# EAGLE design Encoder_y_alarmas (EAGLE 6.1)

## Sheet 1 of 2
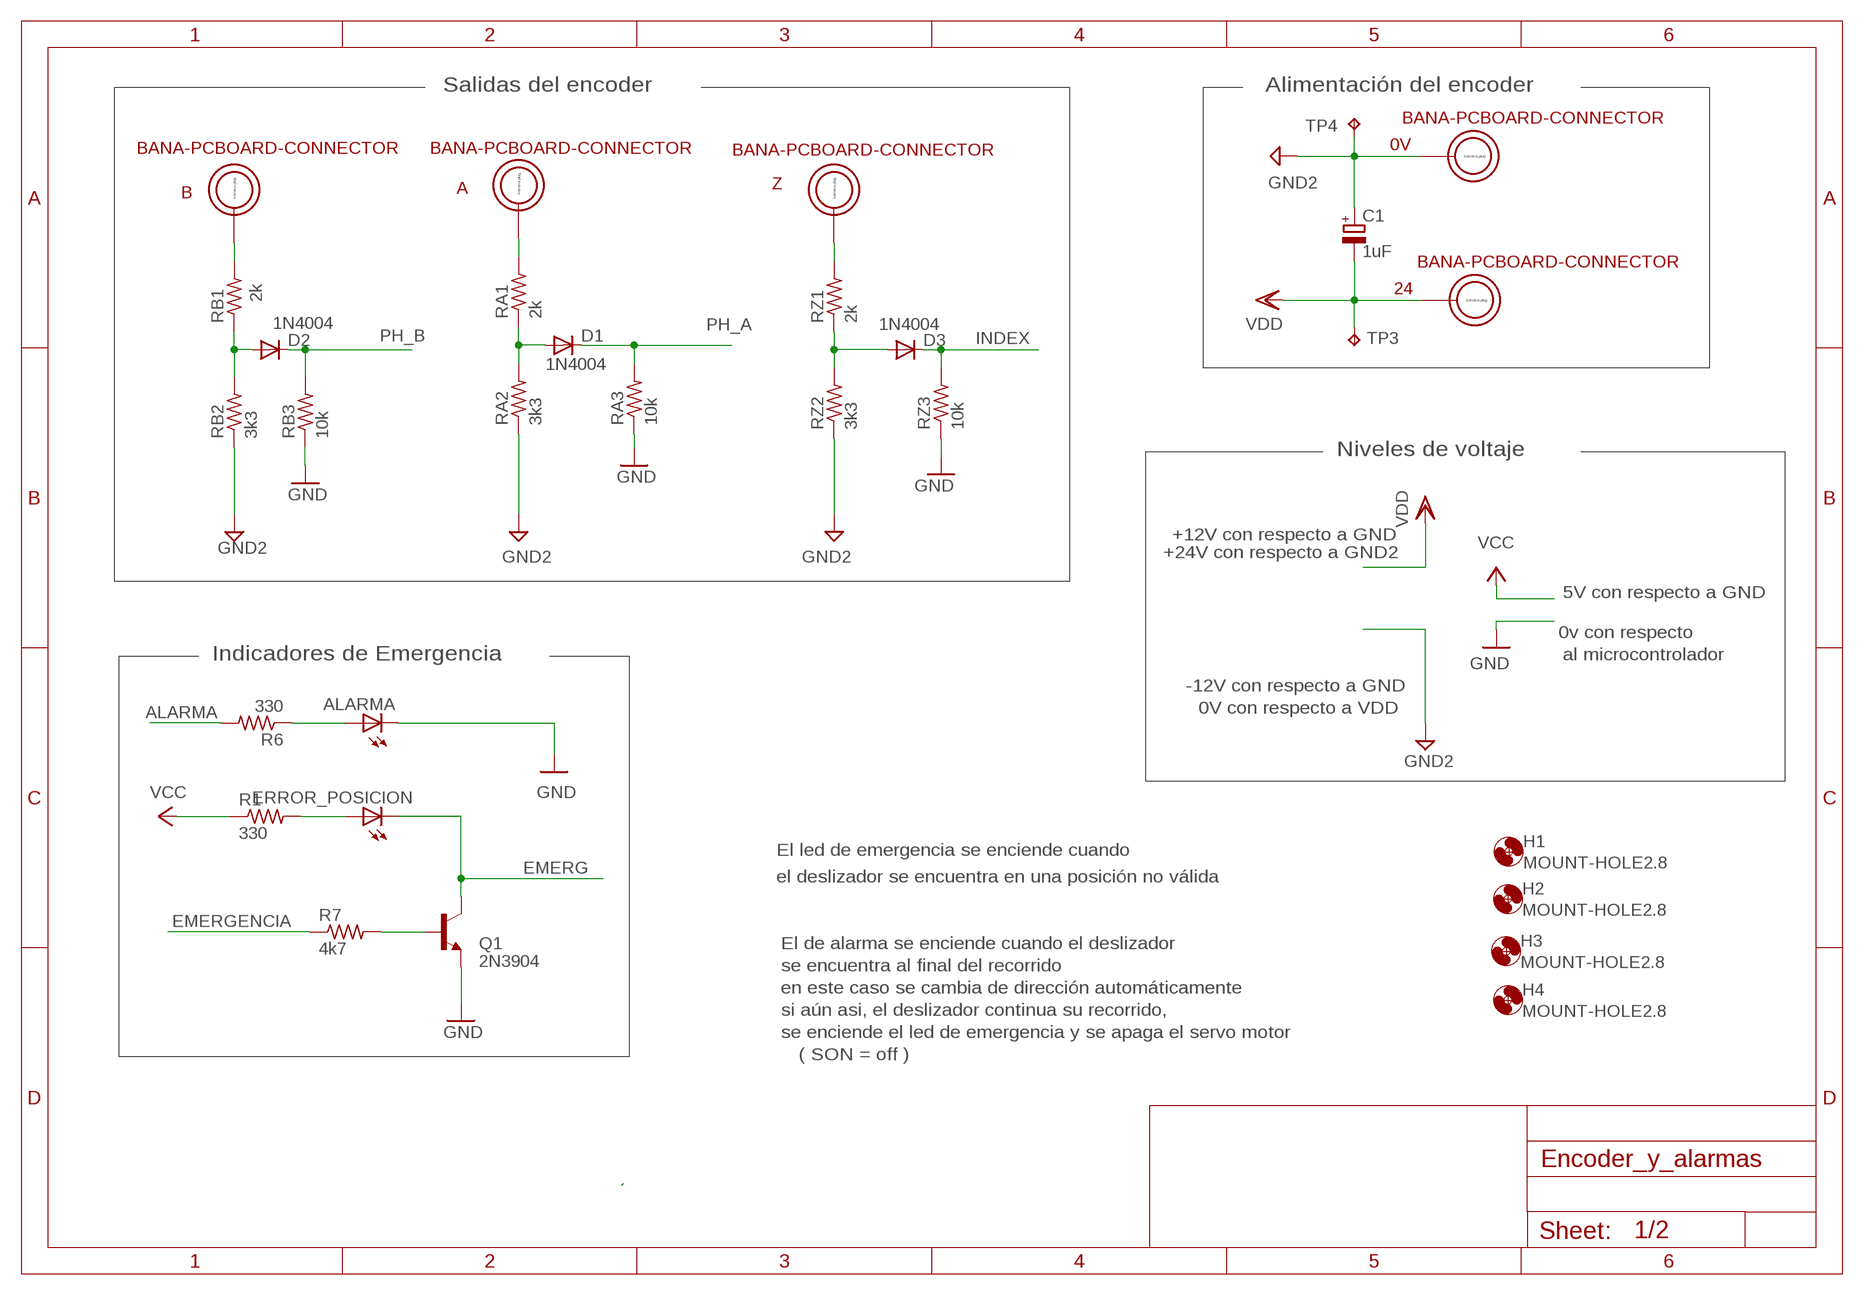
[diagram p0: schematic, sheet 1]

### Parts
0V  BANA-PCBOARD-CONNECTOR  [BANA_PLUG]
24  BANA-PCBOARD-CONNECTOR  [BANA_PLUG]
A  BANA-PCBOARD-CONNECTOR  [BANA_PLUG]
ALARMA  LED5MM  [LED5MM]
B  BANA-PCBOARD-CONNECTOR  [BANA_PLUG]
C1  1uF  CPOL-EUE2.5-6  [E2,5-6]
D1  1N4004  [DO41-10]
D2  1N4004  [DO41-10]
D3  1N4004  [DO41-10]
ERROR_POSICION  LED5MM  [LED5MM]
H1  MOUNT-HOLE2.8  [2,8]
H2  MOUNT-HOLE2.8  [2,8]
H3  MOUNT-HOLE2.8  [2,8]
H4  MOUNT-HOLE2.8  [2,8]
Q1  2N3904  [TO92]
R1  330  R-US_0204/7  [0204/7]
R6  330  R-US_0204/7  [0204/7]
R7  4k7  R-US_0204/7  [0204/7]
RA1  2k  R-US_0204/7  [0204/7]
RA2  3k3  R-US_0204/7  [0204/7]
RA3  10k  R-US_0204/7  [0204/7]
RB1  2k  R-US_0204/7  [0204/7]
RB2  3k3  R-US_0204/7  [0204/7]
RB3  10k  R-US_0204/7  [0204/7]
RZ1  2k  R-US_0204/7  [0204/7]
RZ2  3k3  R-US_0204/7  [0204/7]
RZ3  10k  R-US_0204/7  [0204/7]
TP3  TPB2,54  [B2,54]
TP4  TPB2,54  [B2,54]
Z  BANA-PCBOARD-CONNECTOR  [BANA_PLUG]

### Nets
ALARMA: R6.2 ; also sheet 2
EMERG: ERROR_POSICION.K(C) Q1.1(C) ; also sheet 2
EMERGENCIA: R7.1 ; also sheet 2
GND [tierra_5v]: ALARMA.K(C) Q1.3(E) RA3.1 RB3.1 RZ3.1 ; also sheet 2
GND2: 0V.P$1 C1.+ RA2.1 RB2.1 RZ2.1 TP4.TP ; also sheet 2
INDEX: D3.C RZ3.2 ; also sheet 2
N$1: Q1.2(B) R7.2
N$3: ERROR_POSICION.A R1.2
N$6: ALARMA.A R6.1
N$8: D1.A RA1.1 RA2.2
N$10: D2.A RB1.1 RB2.2
N$12: RZ1.2 Z.P$1
N$16: B.P$1 RB1.2
N$17: A.P$1 RA1.2
N$19: D3.A RZ1.1 RZ2.2
PH_A: D1.C RA3.2 ; also sheet 2
PH_B: D2.C RB3.2 ; also sheet 2
VCC [fuente_5v]: R1.1 ; also sheet 2
VDD [fuente_24]: 24.P$1 C1.- TP3.TP ; also sheet 2

### Notes on the sheet
- Salidas del encoder | Alimentación del encoder
- Niveles de voltaje
- +12V con respecto a GND
- +24V con respecto a GND2
- 5V con respecto a GND
- 0v con respecto
- Indicadores de Emergencia | al microcontrolador
- -12V con respecto a GND
- 0V con respecto a VDD
- El led de emergencia se enciende cuando
- el deslizador se encuentra en una posición no válida
- El de alarma se enciende cuando el deslizador
- se encuentra al final del recorrido
- en este caso se cambia de dirección automáticamente
- si aún asi, el deslizador continua su recorrido,
- se enciende el led de emergencia y se apaga el servo motor
- ( SON = off )

## Sheet 2 of 2
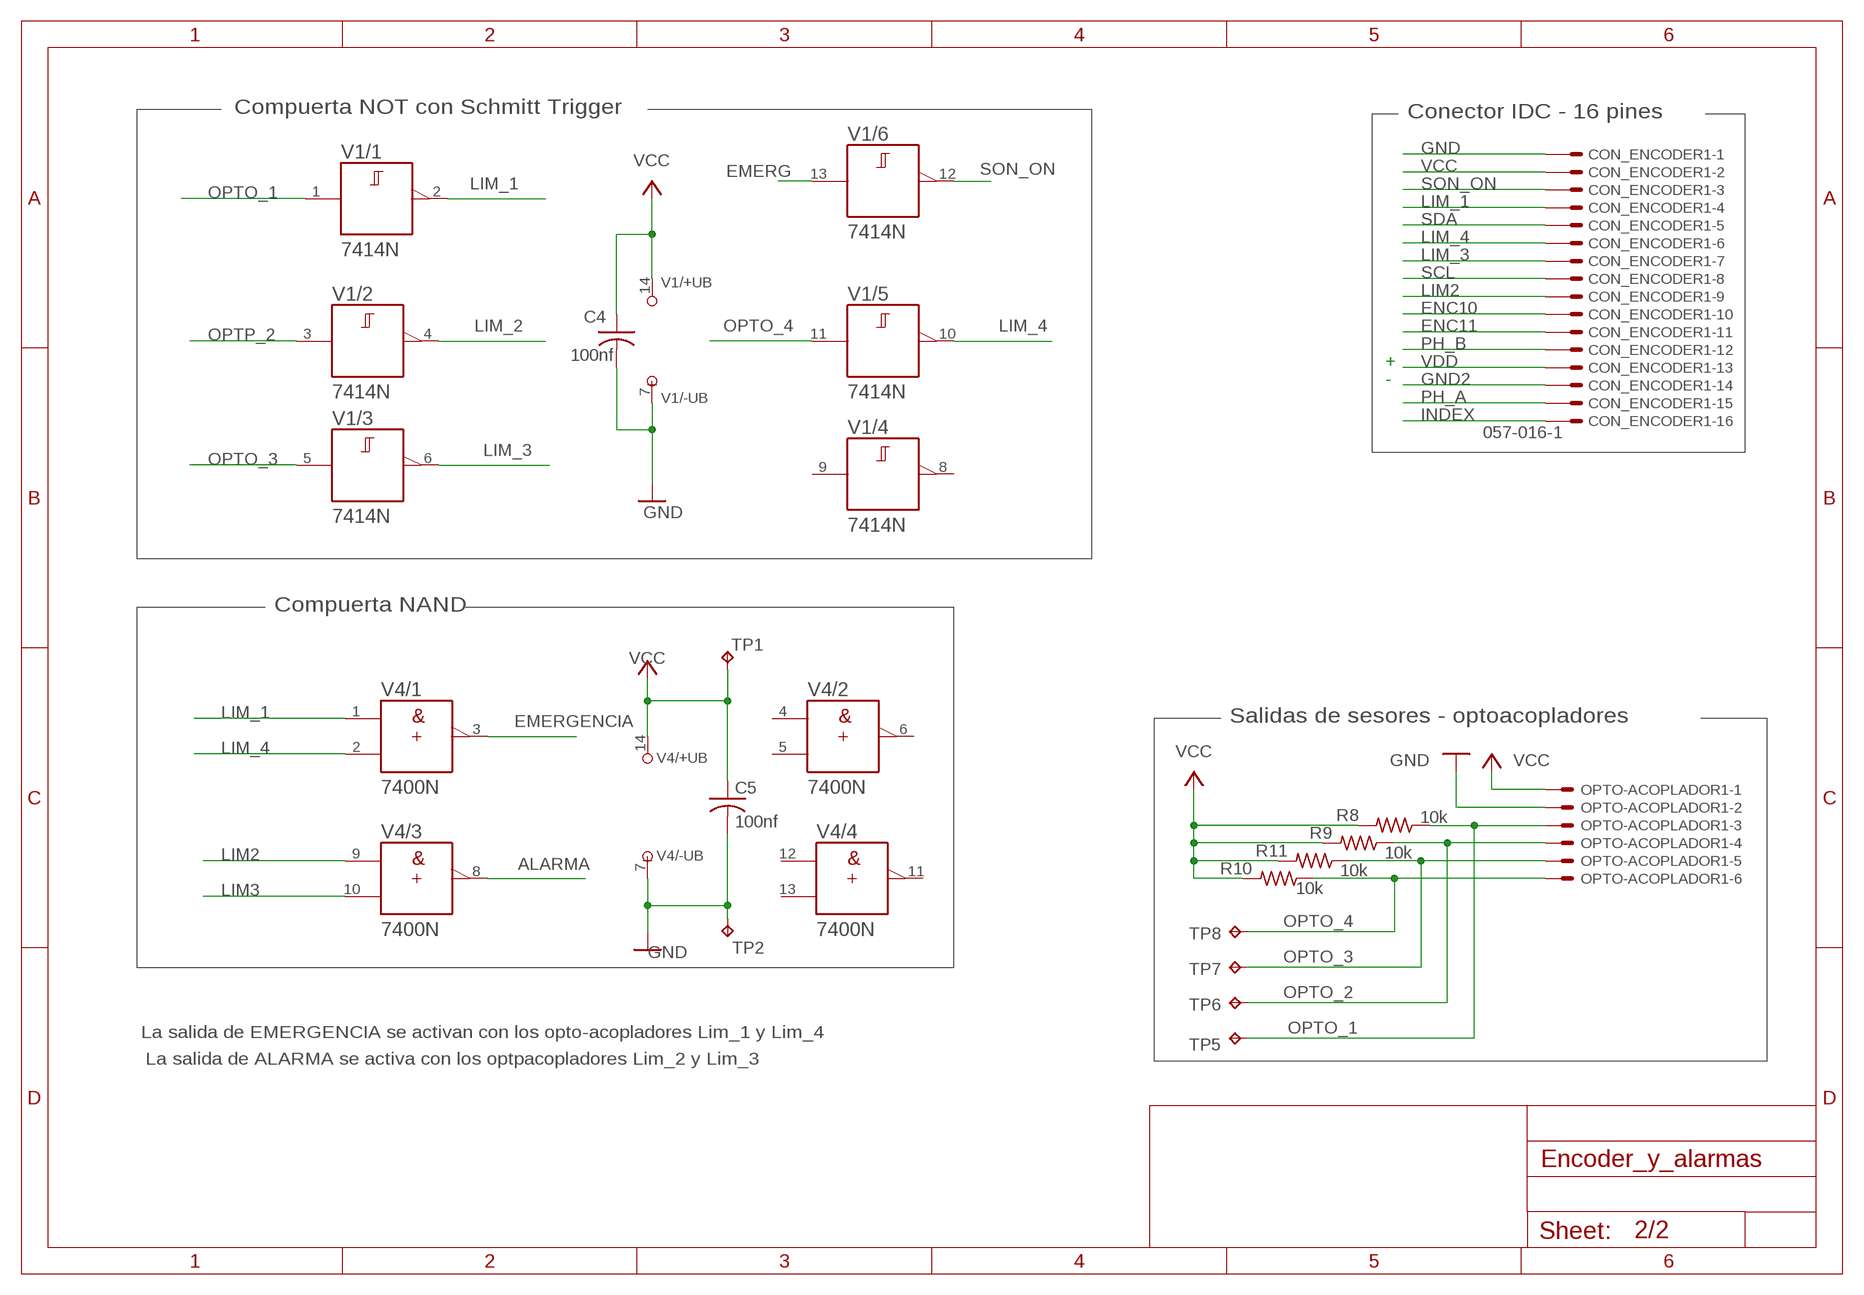
[diagram p1: schematic, sheet 2]

### Parts
C4  100nf  C-US025-024X044  [C025-024X044]
C5  100nf  C-US025-024X044  [C025-024X044]
CON_ENCODER1  057-016-1  [057-016-1]
OPTO-ACOPLADOR1  22-23-2061  [22-23-2061]
R8  10k  R-US_0204/7  [0204/7]
R9  10k  R-US_0204/7  [0204/7]
R10  10k  R-US_0204/7  [0204/7]
R11  10k  R-US_0204/7  [0204/7]
TP1  TPB2,54  [B2,54]
TP2  TPB2,54  [B2,54]
TP5  TPB2,54  [B2,54]
TP6  TPB2,54  [B2,54]
TP7  TPB2,54  [B2,54]
TP8  TPB2,54  [B2,54]
V1  7414N  [DIL14]
V4  7400N  [DIL14]

### Nets
ALARMA: V4.8(/3:Y) ; also sheet 1
EMERG: V1.13(/6:A) ; also sheet 1
EMERGENCIA: V4.3(/1:Y) ; also sheet 1
ENC10: CON_ENCODER1.10
ENC11: CON_ENCODER1.11
GND [tierra_5v]: C4.2 C5.2 CON_ENCODER1.1 OPTO-ACOPLADOR1.2 TP2.TP V1.7(/-UB:-UB) V4.7(/-UB:-UB) ; also sheet 1
GND2: CON_ENCODER1.14 ; also sheet 1
INDEX: CON_ENCODER1.16 ; also sheet 1
LIM2: CON_ENCODER1.9 V4.9(/3:A)
LIM3: V4.10(/3:B)
LIM_1: CON_ENCODER1.4 V1.2(/1:Y) V4.1(/1:A)
LIM_2: V1.4(/2:Y)
LIM_3: CON_ENCODER1.7 V1.6(/3:Y)
LIM_4: CON_ENCODER1.6 V1.10(/5:Y) V4.2(/1:B)
OPTO_1: OPTO-ACOPLADOR1.3 R8.1 TP5.TP V1.1(/1:A)
OPTO_2: OPTO-ACOPLADOR1.4 R9.1 TP6.TP
OPTO_3: OPTO-ACOPLADOR1.5 R11.1 TP7.TP V1.5(/3:A)
OPTO_4: OPTO-ACOPLADOR1.6 R10.1 TP8.TP V1.11(/5:A)
OPTP_2: V1.3(/2:A)
PH_A: CON_ENCODER1.15 ; also sheet 1
PH_B: CON_ENCODER1.12 ; also sheet 1
SCL: CON_ENCODER1.8
SDA: CON_ENCODER1.5
SON_ON: CON_ENCODER1.3 V1.12(/6:Y)
VCC [fuente_5v]: C4.1 C5.1 CON_ENCODER1.2 OPTO-ACOPLADOR1.1 R8.2 R9.2 R10.2 R11.2 TP1.TP V1.14(/+UB:+UB) V4.14(/+UB:+UB) ; also sheet 1
VDD [fuente_24]: CON_ENCODER1.13 ; also sheet 1
Unconnected: V1.8(/4:Y) V1.9(/4:A) V4.4(/2:A) V4.5(/2:B) V4.6(/2:Y) V4.11(/4:Y) V4.12(/4:A) V4.13(/4:B)

### Notes on the sheet
- Compuerta NOT con Schmitt Trigger | Conector IDC - 16 pines
- +
- -
- Compuerta NAND
- Salidas de sesores - optoacopladores
- La salida de EMERGENCIA se activan con los opto-acopladores Lim_1 y Lim_4
- La salida de ALARMA se activa con los optpacopladores Lim_2 y Lim_3

## Library data of the parts
0V 24 A B Z = banana-plug:BANA-PCBOARD-CONNECTOR: Banana Plug to PC Board connector
ALARMA ERROR_POSICION = led:LED: LED OSRAM: - CHIPLED LG R971, LG N971, LY N971, LG Q971, LY Q971, LO R971, LY R971 LH N974, LH R974 LS Q976, LO Q976, LY Q976 LO Q996 - Hyper CHIPLED LW Q18S LB Q993, LB Q99A, LB R99A - SideLED LS A670, LO A670, LY A670, LG A670, LP A670 LB A673, LV A673, LT A673, LW A673 LH A674 LY A675 LS A676, LA A676, LO A676, LY A676, LW A676 LS A679, LY A679, LG A679 - Hyper Micro SIDELED® LS Y876, LA Y876, LO Y876, LY Y876 LT Y87S - SmartLED LW L88C, LW L88S LB L89C, LB L89S, LG L890 LS L89K, LO L89K, LY L89K LS L896, LA L896, LO L896, LY L896 - TOPLED LS T670, LO T670, LY T670, LG T670, LP T670 LSG T670, LSP T670, LSY T670, LOP T670, LYG T670 LG T671, LOG T671, LSG T671 LB T673, LV T673, LT T673, LW T673 LH T674 LS T676, LA T676, LO T676, LY T676, LB T676, LH T676, LSB T676, LW T676 LB T67C, LV T67C, LT T67C, LS T67K, LO T67K, LY T67K, LW E67C LS E67B, LA E67B, LO E67B, LY E67B, LB E67C, LV E67C, LT E67C LW T67C LS T679, LY T679, LG T679 LS T770, LO T770, LY T770, LG T770, LP T770 LB T773, LV T773, LT T773, LW T773 LH T774 LS E675, LA E675, LY E675, LS T675 LS T776, LA T776, LO T776, LY T776, LB T776 LHGB T686 LT T68C, LB T68C - Hyper Mini TOPLED® LB M676 - Mini TOPLED Santana® LG M470 LS M47K, LO M47K, LY M47K Source: http://www.osram.convergy.de LUXEON: - LUMILED® LXK2-PW12-R00, LXK2-PW12-S00, LXK2-PW14-U00, LXK2-PW14-V00 LXK2-PM12-R00, LXK2-PM12-S00, LXK2-PM14-U00 LXK2-PE12-Q00, LXK2-PE12-R00, LXK2-PE12-S00, LXK2-PE14-T00, LXK2-PE14-U00 LXK2-PB12-K00, LXK2-PB12-L00, LXK2-PB12-M00, LXK2-PB14-N00, LXK2-PB14-P00, LXK2-PB14-Q00 LXK2-PR12-L00, LXK2-PR12-M00, LXK2-PR14-Q00, LXK2-PR14-R00 LXK2-PD12-Q00, LXK2-PD12-R00, LXK2-PD12-S00 LXK2-PH12-R00, LXK2-PH12-S00 LXK2-PL12-P00, LXK2-PL12-Q00, LXK2-PL12-R00 Source: www.luxeon.com KINGBRIGHT: KA-3528ASYC Source: www.kingbright.com
C1 = resistor:CPOL-EU: POLARIZED CAPACITOR, European symbol
C4 C5 = resistor:C-US: CAPACITOR, American symbol
CON_ENCODER1 = con-panduit:057-016-: CONNECTOR 10-pin series 057 contact pc board low profile headers; OC_FARNELL: unknown; OC_NEWARK: unknown
D1-D3 = diode:1N4004: DIODE general purpose rectifier, 1 A
H1-H4 = holes:MOUNT-HOLE: MOUNTING HOLE with drill center marker
OPTO-ACOPLADOR1 = con-molex:22-23-2061: .100" (2.54mm) Center Header - 6 Pin; MF: MOLEX; MPN: 22-23-2061; OC_FARNELL: 1462922; OC_NEWARK: 27C1933
Q1 = -redpic-diode-transistor:2N3904: NPN Transistor
R1 R6-R11 RA1-RA3 RB1-RB3 RZ1-RZ3 = rcl:R-US_: RESISTOR, American symbol
TP1-TP8 = testpad:TP: Test pad
V1 = 74ttl-din:74*14: Hex schmitt trigger INVERTER
V4 = 74ttl-din:74*00: Quad 2-input NAND gate

## Net classes
1 fuente_24: width 0.406 mm, clearance 0.305 mm
3 fuente_5v: width 0.356 mm
4 tierra_5v: width 0.356 mm

## Board
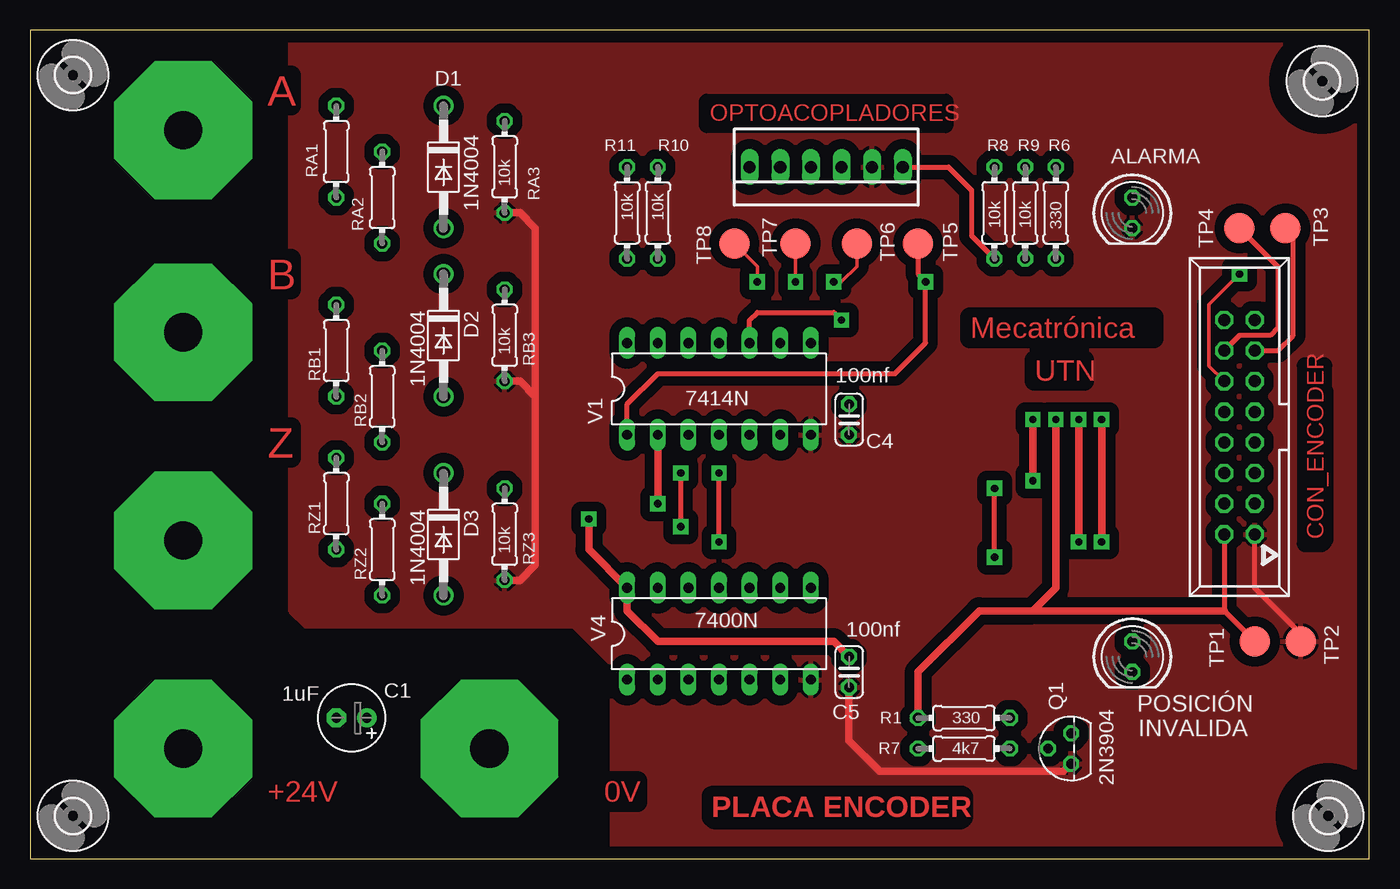
[diagram p2: board, top side]
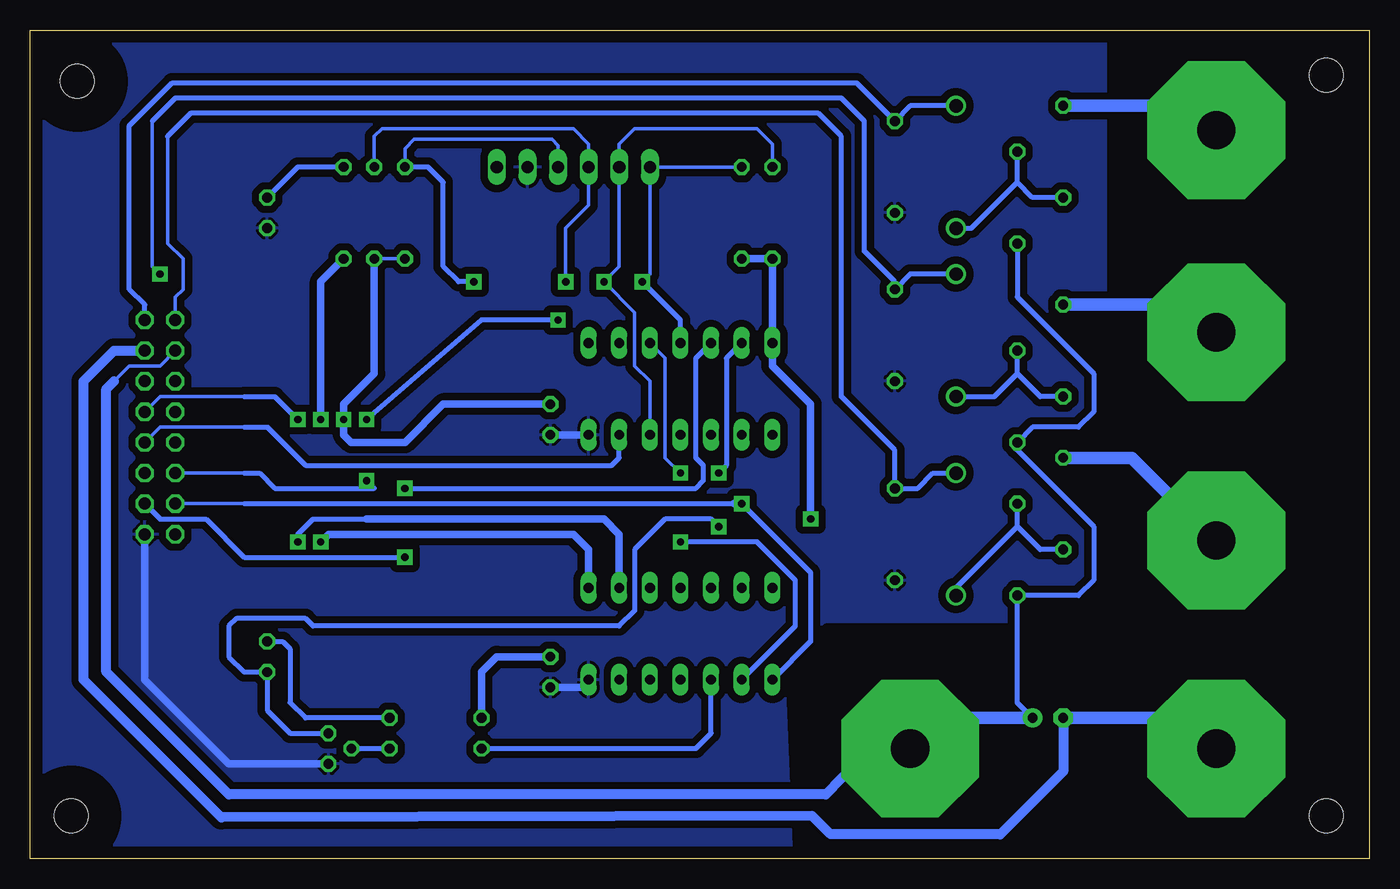
[diagram p3: board, bottom side, seen from below]

Size 111.11 x 68.76 mm. Coordinates in mm from the lower left corner, seen from the top.
Outline: 0,0 111.11,0 111.11,68.76 0,68.76 0,0
Copper layers (1*16): Top 0.035mm / dielectric 1.5mm / Bottom 0.035mm
Design rules: minimum track width 10mil, minimum drill 24mil, track to track 8mil, track to pad 8mil, pad to pad 8mil, via to via 8mil, smd to smd 8mil, copper to edge 40mil, drill to drill 8mil, minimum pad ring 10mil, minimum via ring 8mil, stop-mask expansion 4mil, vias tented up to drill 0mil, thermal gap 10mil

### Footprints (pad centres in the part's own frame; a part is rotated, then mirrored left to right if it is on the bottom)
BANA_PLUG = drill 3.175 pad 11.43 octagon: P$1 0,0
LED5MM = drill 0.813 octagon: A -1.27,0; K 1.27,0
E2,5-6 = drill 0.813 pad 1.6: + -1.27,0 | drill 0.813 pad 1.6 octagon: - 1.27,0
C025-024X044 = drill 0.813 octagon: 1 -1.27,0; 2 1.27,0
057-016-1 = drill 1 octagon: 1 -8.89,-1.27; 2 -8.89,1.27; 3 -6.35,-1.27; 4 -6.35,1.27; 5 -3.81,-1.27; 6 -3.81,1.27; 7 -1.27,-1.27; 8 -1.27,1.27; 9 1.27,-1.27; 10 1.27,1.27; 11 3.81,-1.27; 12 3.81,1.27; 13 6.35,-1.27; 14 6.35,1.27; 15 8.89,-1.27; 16 8.89,1.27
DO41-10 = drill 1.118: A 5.08,0; C -5.08,0
2,8 = hole 2.8: 0,0
22-23-2061 = drill 1 long: 1 -6.35,0; 2 -3.81,0; 3 -1.27,0; 4 1.27,0; 5 3.81,0; 6 6.35,0
TO92 = drill 0.813 octagon: 1 1.27,0; 2 0,1.905; 3 -1.27,0
0204/7 = drill 0.813 octagon: 1 -3.81,0; 2 3.81,0
B2,54 = smd 2.54 x 2.54: TP 0,0
DIL14 = drill 0.813 long: 1 -7.62,-3.81; 2 -5.08,-3.81; 3 -2.54,-3.81; 4 0,-3.81; 5 2.54,-3.81; 6 5.08,-3.81; 7 7.62,-3.81; 8 7.62,3.81; 9 5.08,3.81; 10 2.54,3.81; 11 0,3.81; 12 -2.54,3.81; 13 -5.08,3.81; 14 -7.62,3.81

### Placement (x,y rotation side)
0V  38.1,9.14 0 top
24  12.7,9.14 0 top
A  12.7,60.45 0 top
ALARMA  91.44,53.59 270 top
B  12.7,43.69 0 top
C1  26.67,11.68 180 top
C4  67.95,36.45 270 top
C5  67.95,15.49 270 top
CON_ENCODER1  100.33,35.81 90 top
D1  34.29,57.4 270 top
D2  34.29,43.43 270 top
D3  34.29,26.92 270 top
ERROR_POSICION  91.44,16.76 270 top
H1  3.56,3.56 0 top
H2  3.56,65.02 0 top
H3  107.19,64.52 0 top
H4  107.7,3.56 0 top
OPTO-ACOPLADOR1  66.04,57.4 180 top
Q1  86.36,9.14 90 top
R1  77.47,11.68 0 top
R6  85.09,53.59 270 top
R7  77.47,9.14 0 top
R8  80.01,53.59 270 top
R9  82.55,53.59 270 top
R10  52.07,53.59 270 top
R11  49.53,53.59 270 top
RA1  25.4,58.67 90 top
RA2  29.21,54.86 90 top
RA3  39.37,57.4 90 top
RB1  25.4,42.16 90 top
RB2  29.21,38.35 90 top
RB3  39.37,43.43 90 top
RZ1  25.4,29.46 90 top
RZ2  29.21,25.65 90 top
RZ3  39.37,26.92 90 top
TP1  101.6,18.03 0 top
TP2  105.41,18.03 0 top
TP3  104.14,52.32 0 top
TP4  100.33,52.32 0 top
TP5  73.66,51.05 270 top
TP6  68.58,51.05 270 top
TP7  63.5,51.05 270 top
TP8  58.42,51.05 270 top
V1  57.15,38.99 0 top
V4  57.15,18.67 0 top
Z  12.7,26.42 0 top

### Tracks (layer width: path | path; a pad name or v marks a point on that pad's centre or on a via)
ALARMA  (via drill 0.6 pad 1.27)
  Top 0.61: v87,26.29 v87,36.45
  Bottom 0.61: V4.8 64.77,25.65 66.04,26.92 86.36,26.92 v87,26.29 | v87,36.45 87,47.88 R6.2
EMERG  (via drill 0.6 pad 1.27)
  Top 0.406: v53.98,32 v53.98,27.56
  Bottom 0.406: Q1.1 89.54,10.41 91.44,12.32 ERROR_POSICION.K 93.35,15.49 94.62,16.76 94.62,19.3 93.98,19.94 88.27,19.94 87.63,19.3 62.23,19.3 60.96,20.57 60.96,25.65 58.42,28.19 54.61,28.19 v53.98,27.56 | V1.13 53.34,41.53 53.34,32.64 v53.98,32
EMERGENCIA
  Bottom 0.406: R7.1 55.88,9.14 54.61,10.41 V4.3
GND
  Top 0.406: TP2.TP 105.41,18.67 101.6,22.48 CON_ENCODER1.1
  Top 0.61: C5.2 67.95,9.78 70.48,7.24 85.73,7.24 Q1.3 | RZ3.1 40.64,23.11 41.91,24.38 41.91,38.35 | 41.91,38.35 40.64,39.62 RB3.1 | RA3.1 40.64,53.59 41.91,52.32 41.91,38.35
  Bottom 0.61: C5.2 65.41,14.22 V4.7 | Q1.3 94.62,7.87 101.6,14.86 CON_ENCODER1.1 | V1.7 C4.2
  pour Bottom (isolate 0.61, rank 3): 0,0 111.12,0 111.12,68.45 0,68.45
  pour Top (isolate 0.813): 21.59,68.45 21.59,20.57 22.86,19.3 45.09,19.3 48.26,16.13 48.26,0 111.12,0 111.12,68.45
GND2
  Top 0.406: TP4.TP 103.51,49.15 103.51,44.07 102.87,43.43 100.33,43.43 CON_ENCODER1.14
  Bottom 0.305: 104.14,39.62 102.87,40.89 100.33,40.89 CON_ENCODER1.14
  Bottom 0.406: RA2.1 29.21,46.61 22.86,40.26 22.86,37.08 24.13,35.81 27.94,35.81 RB2.1 29.21,33.91 22.86,27.56 22.86,23.11 24.13,21.84 RZ2.1 29.21,12.95 C1.+
  Bottom 0.813: 0V.P$1 41.4,9.14 45.09,5.33 94.62,5.33 104.78,15.49 104.78,38.99 104.14,39.62
  Bottom 1.016: 0V.P$1 35.31,11.68 C1.+
INDEX
  Bottom 0.305: CON_ENCODER1.16 99.06,46.61 98.43,47.24 98.43,49.78 99.7,51.05 99.7,59.94
  Bottom 0.406: D3.C 36.2,32 37.46,30.73 RZ3.2 39.37,33.91 43.81,38.35 43.81,59.94 45.72,61.85 97.79,61.85 99.7,59.94
LIM2  (via drill 0.6 pad 1.27)
  Top 0.61: v88.9,36.45 v88.9,26.29
  Bottom 0.305: CON_ENCODER1.9 100.33,38.35 93.35,38.35
  Bottom 0.406: 93.35,38.35 90.81,38.35 v88.9,36.45 | v88.9,26.29 88.9,26.92 87.63,28.19 83.19,28.19
  Bottom 0.61: V4.9 62.23,26.92 63.5,28.19 83.19,28.19
LIM_1  (via drill 0.6 pad 1.27)
  Top 0.61: V1.2 v52.07,29.46
  Bottom 0.305: CON_ENCODER1.4 93.35,29.46
  Bottom 0.406: 93.35,29.46 v52.07,29.46 46.35,23.75 46.35,18.03 V4.1
  Bottom 0.61: v52.07,29.46 52.7,29.46
LIM_3
  Bottom 0.305: CON_ENCODER1.7 100.33,35.81 93.35,35.81
  Bottom 0.406: 93.35,35.81 91.44,35.81 88.27,32.64 62.87,32.64 62.23,33.27 V1.6
LIM_4  (via drill 0.6 pad 1.27)
  Top 0.406: v57.15,26.29 v57.15,32 | V1.10 59.69,44.7 60.32,45.34 66.68,45.34 v67.31,44.7
  Top 0.61: v83.19,31.37 v83.19,36.45
  Bottom 0.305: CON_ENCODER1.6 93.35,32 | V1.10 58.42,41.53 58.42,33.27 v57.15,32
  Bottom 0.406: 93.35,32 92.08,32 90.81,30.73 82.55,30.73 v83.19,31.37 | V4.2 47.62,19.3 47.62,23.11 50.8,26.29 v57.15,26.29 | v67.31,44.7 73.66,44.7 v83.19,36.45
N$1
  Bottom 0.406: Q1.2 R7.2
N$2
  cutout Bottom: 0,68.45 21.59,68.45 21.59,20.57 22.86,19.3 45.09,19.3 48.26,16.13 47.62,0 0,0
N$3
  Bottom 0.406: R1.2 88.27,11.68 89.54,12.95 89.54,17.4 90.17,18.03 ERROR_POSICION.A
N$4
  cutout Top: 78.11,5.07 78.11,3.56 arc-90 77.08,2.54 56.9,2.54 arc-90 55.88,3.56 55.88,5.08 arc-90 56.77,5.97 77.21,5.97 arc-90
N$5
  cutout Top: 56.13,63.37 75.95,63.37 arc-90 76.45,62.87 76.45,60.83 arc-90 75.95,60.33 56.13,60.33 arc-90 55.63,60.83 55.63,62.87 arc-90
N$6
  Bottom 0.406: R6.1 88.9,57.4 ALARMA.A
N$7
  cutout Top: 105.28,40.89 105.28,26.16 arc90 105.79,25.65 107.06,25.65 arc90 107.82,26.42 107.82,40.89 arc90 107.32,41.4 105.79,41.4 arc90
N$8
  Bottom 0.406: RA1.1 27.94,54.86 29.21,56.13 | 29.21,56.13 RA2.2 | D1.A 33.02,52.32 29.21,56.13
N$10
  Bottom 0.406: RB1.1 27.3,38.35 29.21,40.26 | 29.21,40.26 RB2.2 | D2.A 31.11,38.35 29.21,40.26
N$12
  Bottom 1.016: Z.P$1 13.34,26.92 19.68,33.27 RZ1.2
N$16
  Bottom 1.016: RB1.2 14.99,45.97 B.P$1
N$17
  Bottom 1.016: RA1.2 14.73,62.48 A.P$1
N$19
  Bottom 0.406: RZ1.1 27.3,25.65 29.21,27.56 | 29.21,27.56 RZ2.2 | D3.A 34.29,22.48 29.21,27.56
OPTO_1  (via drill 0.6 pad 1.27)
  Top 0.406: TP5.TP 73.66,48.51 v74.3,47.88 74.3,42.8 71.76,40.26 52.07,40.26 49.53,37.72 V1.1
  Bottom 0.305: R8.1 80.01,58.93 79.25,59.69 67.82,59.69 67.31,59.18 OPTO-ACOPLADOR1.3
  Bottom 0.406: v74.3,47.88 75.57,47.88 76.84,49.15 76.84,56.13 78.11,57.4 R8.1
OPTO_2  (via drill 0.6 pad 1.27)
  Top 0.305: v66.68,47.88 67.31,47.88 68.58,49.15 TP6.TP
  Bottom 0.305: R9.1 82.55,59.94 81.92,60.58 66.04,60.58 64.77,59.31 OPTO-ACOPLADOR1.4 64.77,54.23 66.68,52.32 v66.68,47.88
OPTO_3  (via drill 0.6 pad 1.27)
  Top 0.305: v63.5,47.88 TP7.TP
  Bottom 0.305: R11.1 49.53,59.31 50.8,60.58 60.96,60.58 62.23,59.31 OPTO-ACOPLADOR1.5 62.23,49.15 v63.5,47.88 60.96,45.34 60.96,40.89 59.69,39.62 V1.5
OPTO_4  (via drill 0.6 pad 1.27)
  Top 0.305: v60.32,47.88 60.32,49.15 TP8.TP
  Bottom 0.305: R10.1 OPTO-ACOPLADOR1.6 59.69,48.51 v60.32,47.88
  Bottom 0.406: V1.11 57.15,44.7 v60.32,47.88
PH_A
  Bottom 0.406: D1.C 38.1,62.48 RA3.2 42.55,64.39 99.31,64.39 102.87,60.83 102.87,47.24 101.6,45.97 CON_ENCODER1.15
PH_B  (via drill 0.6 pad 1.27)
  Top 0.305: CON_ENCODER1.12 97.79,40.89 97.79,45.97 v100.33,48.51
  Bottom 0.305: 100.97,61.21 100.97,49.15 v100.33,48.51
  Bottom 0.406: D2.C 38.1,48.51 RB3.2 39.37,47.88 41.91,50.42 41.91,61.21 43.81,63.12 99.06,63.12 100.97,61.21
SON_ON  (via drill 0.6 pad 1.27)
  Top 0.406: v80.01,25.02 v80.01,30.73
  Bottom 0.406: CON_ENCODER1.3 100.33,28.19 96.52,28.19 93.35,25.02 v80.01,25.02 | v80.01,30.73 55.88,30.73 55.24,31.37 55.24,32.64 55.88,33.27 55.88,41.53 V1.12
VCC  (via drill 0.6 pad 1.27)
  Top 0.406: CON_ENCODER1.2 99.06,20.57 TP1.TP | OPTO-ACOPLADOR1.1 76.2,57.4 78.11,55.5 78.11,51.69 R8.2
  Top 0.61: v46.35,28.19 46.35,25.65 V4.14 49.53,20.57 52.07,18.03 66.68,18.03 C5.1 | 99.06,20.57 83.19,20.57 | R1.1 73.66,15.49 78.74,20.57 83.19,20.57 | 83.19,20.57 85.09,22.48 v85.09,36.45
  Bottom 0.305: R9.2 R8.2
  Bottom 0.61: R10.2 R11.2 V1.14 49.53,40.89 46.35,37.72 v46.35,28.19 | R1.1 73.66,15.49 72.39,16.76 C5.1 | C4.1 76.84,37.72 80.01,34.54 84.46,34.54 85.09,35.18 v85.09,36.45 85.09,37.72 82.55,40.26 R9.2
VDD
  Top 0.406: CON_ENCODER1.13 103.51,42.16 104.78,43.43 104.78,51.69 TP3.TP
  Bottom 0.813: C1.- 25.4,7.24 30.62,2.02 44.7,2.03 46.23,3.56 95.25,3.43 106.68,14.86 106.68,39.62 104.14,42.16 CON_ENCODER1.13
  Bottom 1.016: 24.P$1 12.7,9.65 14.73,11.68 C1.-

### Text on the board
Top: A | OPTOACOPLADORES | B | Mecatrónica | UTN | Z | CON_ENCODER | +24V | 0V | PLACA ENCODER
tNames: POSICIÓN | INVALIDA
Measures: +24- | +5V-